# EAGLE schematic IMU (EAGLE 7.2.0)
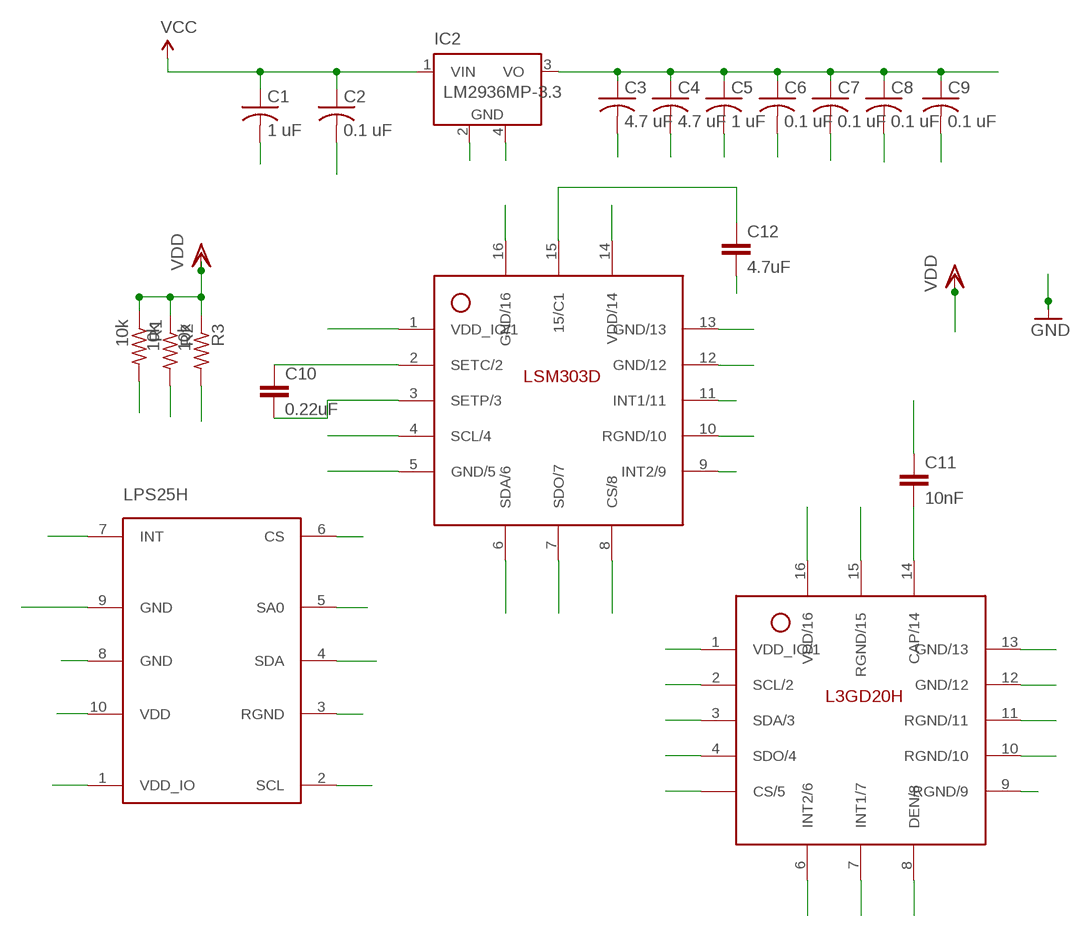
[diagram p0: schematic, sheet 1]

## Parts
C1  1 uF  C-USC0805  [C0805]
C2  0.1 uF  C-USC0805  [C0805]
C3  4.7 uF  C-USC0805  [C0805]
C4  4.7 uF  C-USC0805  [C0805]
C5  1 uF  C-USC0805  [C0805]
C6  0.1 uF  C-USC0805  [C0805]
C7  0.1 uF  C-USC0805  [C0805]
C8  0.1 uF  C-USC0805  [C0805]
C9  0.1 uF  C-USC0805  [C0805]
C10  0.22uF  0.22UF50V-20%,+80%(0603)  [0603-CAP]
C11  10nF  10NF/10000PF-50V-10%(0603)  [0603-CAP]
C12  4.7uF  4.7UF-6.3V-10%(0603)0603  [0603-CAP]
IC2  LM2936MP-3.3  [SOT223]
LPS25H  LPS25H  [LPS25H]
R1  10k  R-US_R0805  [R0805]
R2  10k  R-US_R0805  [R0805]
R3  10k  R-US_R0805  [R0805]
U$1  L3GD20H  [LGA-16]
U$2  LSM303D  [LGA-16]

## Nets
GND: C1.2 C2.2 C3.2 C4.2 C5.2 C6.2 C7.2 C8.2 C9.2 C11.1 C12.2 IC2.2(GND) IC2.4(GND) LPS25H.8(GND) LPS25H.9(GND) U$1.8(DEN/8) U$1.9(RGND/9) U$1.10(RGND/10) U$1.11(RGND/11) U$1.12(GND/12) U$1.13(GND/13) U$1.16(VDD/16) U$2.5(GND/5) U$2.10(RGND/10) U$2.12(GND/12) U$2.13(GND/13) U$2.16(GND/16)
N$2: C10.1 U$2.2(SETC/2)
N$3: C10.2 U$2.3(SETP/3)
N$9: U$2.9(INT2/9)
N$11: U$2.11(INT1/11)
N$15: C12.1 U$2.15(15/C1)
N$20: LPS25H.3(RGND)
N$22: LPS25H.7(INT)
N$24: U$1.6(INT2/6)
N$25: U$1.7(INT1/7)
N$32: C11.2 U$1.14(CAP/14)
SCL: LPS25H.2(SCL) R2.2 U$1.2(SCL/2) U$2.4(SCL/4)
SDA: LPS25H.4(SDA) R1.2 U$1.3(SDA/3) U$2.6(SDA/6)
SDO: LPS25H.5(SA0) R3.2 U$1.4(SDO/4) U$2.7(SDO/7)
VCC: C1.1 C2.1 IC2.1(VIN)
VDD: C3.1 C4.1 C5.1 C6.1 C7.1 C8.1 C9.1 IC2.3(VO) LPS25H.1(VDD_IO) LPS25H.6(CS) LPS25H.10(VDD) R1.1 R2.1 R3.1 U$1.1(VDD_IO/1) U$1.5(CS/5) U$1.15(RGND/15) U$2.1(VDD_IO/1) U$2.8(CS/8) U$2.14(VDD/14)

## Library data of the parts
C1-C9 = adafruit:C-US: CAPACITOR, American symbol
C10 = SparkFun-Capacitors:0.22UF50V-20%,+80%(0603): CAP-09885; PROD_ID: CAP-09885
C11 = SparkFun-Capacitors:10NF/10000PF-50V-10%(0603): CAP-00867; PROD_ID: CAP-00867
C12 = SparkFun-Capacitors:4.7UF-6.3V-10%(0603): CAP-08280; PROD_ID: CAP-08280
IC2 = national-semiconductor:LM2936MP?*: Ultra-Low Quiescent Current LDO Voltage Regulator Source: Data sheet <http://www.national.com/ds/LM/LM2936.pdf>; MF: NATIONAL SEMICONDUCTOR; MPN: LM2936MP-3.3/NOPB; OC_FARNELL: 1469062; OC_NEWARK: 41K4523
LPS25H = chips:LPS25H: ST-Micro Piezoresistive pressure sensor; DIGIKEY: 497-15070-1-ND
R1-R3 = adafruit:R-US_: RESISTOR, American symbol
U$1 = IMU_chips:L3GD20H
U$2 = IMU_chips:LSM303D